# EAGLE design controladorBrassagem (EAGLE 9.6.2)
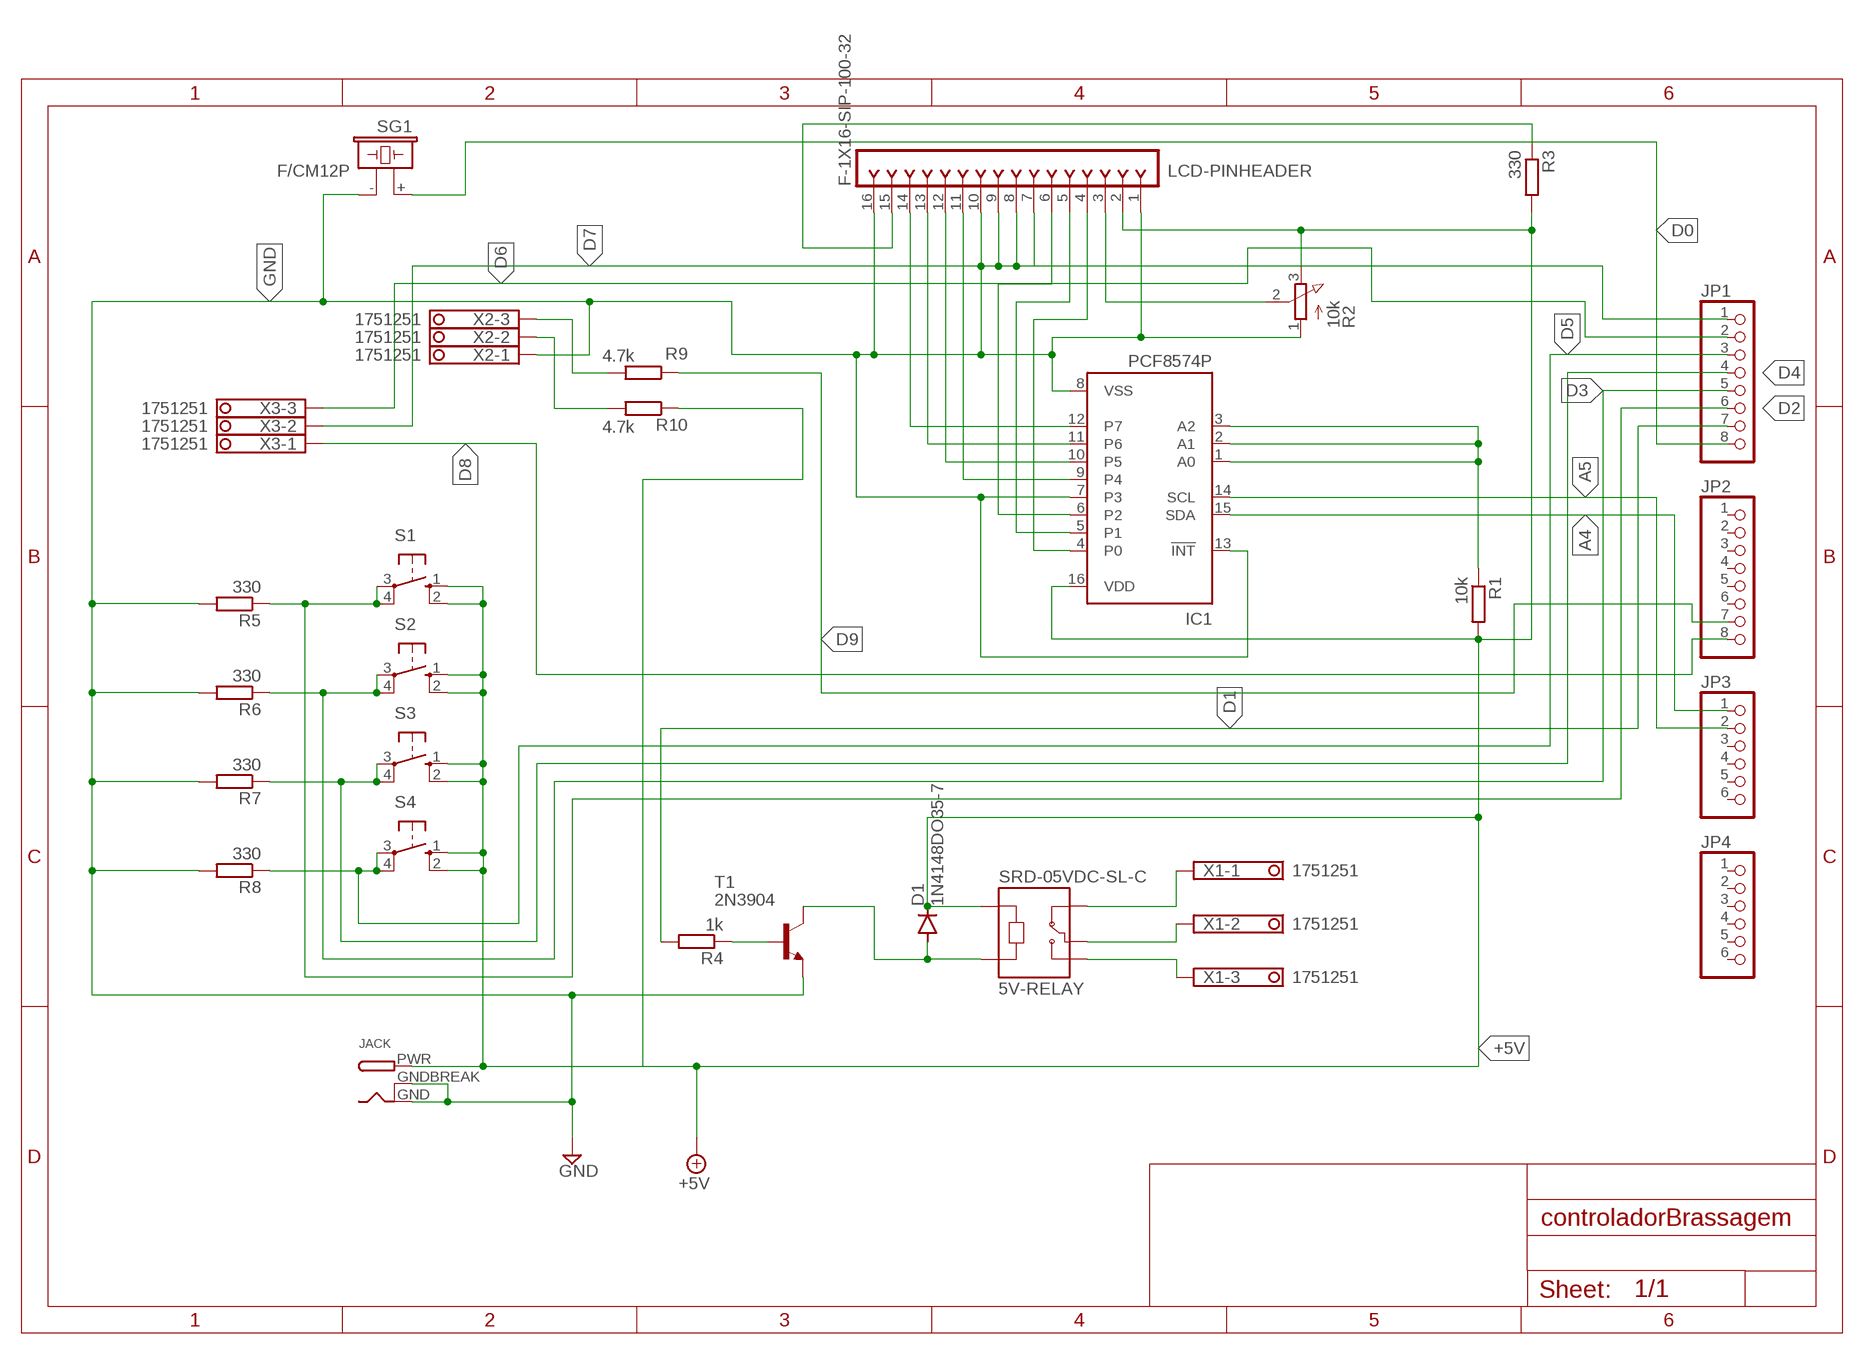
[diagram p0: schematic, sheet 1]

## Parts
5V-RELAY  SRD-05VDC-SL-C  [RELAY_SRD-05VDC-SL-C]
D1  1N4148DO35-7  [DO35-7]
IC1  PCF8574P  [DIL16]
JACK  DCBARRELPTH  [DCJACK_2MM_PTH]
JP1  PINHD-1X8  [1X08]
JP2  PINHD-1X8  [1X08]
JP3  PINHD-1X6  [1X06]
JP4  PINHD-1X6  [1X06]
LCD-PINHEADER  F-1X16-SIP-100-32  [SIP-100-16-32]
R1  10k  R-EU_0207/10  [0207/10]
R2  10k  3RP/1610N  [3RP/1610N]
R3  330  R-EU_0207/10  [0207/10]
R4  1k  R-EU_0207/10  [0207/10]
R5  330  R-EU_0207/10  [0207/10]
R6  330  R-EU_0207/10  [0207/10]
R7  330  R-EU_0207/10  [0207/10]
R8  330  R-EU_0207/10  [0207/10]
R9  4.7k  R-EU_0207/10  [0207/10]
R10  4.7k  R-EU_0207/10  [0207/10]
S1  10-XX  [B3F-10XX]
S2  10-XX  [B3F-10XX]
S3  10-XX  [B3F-10XX]
S4  10-XX  [B3F-10XX]
SG1  F/CM12P  [F/CM12P]
T1  2N3904  [TO92]
X1  1751251  [1751251]
X2  1751251  [1751251]
X3  1751251  [1751251]

## Nets
+5V: 5V-RELAY.A2 D1.C IC1.16(VDD) JACK.PWR LCD-PINHEADER.2 R1.2 R2.3(E) R3.2 R10.1 S1.1(S) S1.2(S1) S2.1(S) S2.2(S1) S3.1(S) S3.2(S1) S4.1(S) S4.2(S1)
A4: IC1.15(SDA) JP3.1
A5: IC1.14(SCL) JP3.2
D0: JP1.8 SG1.+
D1: JP1.7 R4.2
D2: JP1.6 R5.1 S1.3(P) S1.4(P1)
D3: JP1.5 R6.1 S2.3(P) S2.4(P1)
D4: JP1.4 R7.1 S3.3(P) S3.4(P1)
D5: JP1.3 R8.1 S4.3(P) S4.4(P1)
D6: JP1.2 X3.3
D7: JP1.1 X3.2
D8: JP2.8 X3.1
D9: JP2.7 R9.1
GND: IC1.7(P3) IC1.8(VSS) IC1.13(!INT) JACK.GND JACK.GNDBREAK LCD-PINHEADER.1 LCD-PINHEADER.7 LCD-PINHEADER.8 LCD-PINHEADER.9 LCD-PINHEADER.10 LCD-PINHEADER.16 R2.1(A) R5.2 R6.2 R7.2 R8.2 SG1.- T1.3(E) X2.1
N$1: IC1.1(A0) IC1.2(A1) IC1.3(A2) R1.1
N$2: LCD-PINHEADER.3 R2.2(S)
N$3: IC1.4(P0) LCD-PINHEADER.4
N$4: IC1.5(P1) LCD-PINHEADER.5
N$5: IC1.6(P2) LCD-PINHEADER.6
N$6: IC1.9(P4) LCD-PINHEADER.11
N$7: IC1.10(P5) LCD-PINHEADER.12
N$8: IC1.11(P6) LCD-PINHEADER.13
N$9: IC1.12(P7) LCD-PINHEADER.14
N$10: LCD-PINHEADER.15 R3.1
N$11: R9.2 X2.3
N$12: R4.1 T1.2(B)
N$13: 5V-RELAY.A1 D1.A T1.1(C)
N$14: 5V-RELAY.NC X1.1
N$15: 5V-RELAY.COM X1.2
N$16: 5V-RELAY.NO X1.3
N$17: R10.2 X2.2
Unconnected: JP2.1 JP2.2 JP2.3 JP2.4 JP2.5 JP2.6 JP3.3 JP3.4 JP3.5 JP3.6 JP4.1 JP4.2 JP4.3 JP4.4 JP4.5 JP4.6

## Library data of the parts
5V-RELAY = SRD-05VDC-SL-C:SRD-05VDC-SL-C: 5V Trigger Relay Module For Arduino And Raspberry Pi 5V Trigger Relay Module For Arduino And Raspberry Pi Check prices <https://pricing.snapeda.com/parts/SRD-05VDC-SL-C/Songle%20Relay/view-part?ref=eda>; AVAILABILITY: No availability data; DESCRIPTION: 5V Trigger Relay Module For Arduino And Raspberry Pi 5V Trigger Relay Module For Arduino And Raspberry Pi; MF: Songle Relay; MP: SRD-05VDC-SL-C; PACKAGE: None; PRICE: None
D1 = diode:1N4148: DIODE high speed (Philips)
IC1 = micro-philips:PCF8574: I2C-Bus Remote 8-bit I/O expander http://www.semiconductors.philips.com/acrobat_download/datasheets/PCF8574_4.pdf; MPN: PCF8574PN; OC_FARNELL: 204020; OC_NEWARK: 11N8515
JACK = adafruit:DCBARREL: 2.0mm DC Barrel Jack DCJACK_2MM_PTH - Through Hole Jack (4UConnector: 05537)
JP1 JP2 = pinhead:PINHD-1X8: PIN HEADER
JP3 JP4 = pinhead:PINHD-1X6: PIN HEADER
LCD-PINHEADER = con-headers-jp:F-1X16-: FEMALE HEADER
R1 R3-R10 = resistor:R-EU_: RESISTOR, European symbol
R2 = pot:3RP/1610N: 16mm Potentiometer one level Source: http://www.alphapotentiometers.net/html/16mm_pot_2.html
S1-S4 = DC_LOAD_AU:10-XX: OMRON SWITCH; MPN: B3F-1000; OC_FARNELL: 176432; OC_NEWARK: 36M3542
SG1 = buzzer:F/CM12P: BUZZER Source: Buerklin; OC_FARNELL: unknown; OC_NEWARK: unknown
T1 = transistor:2N3904: NPN TRANSISTOR
X1-X3 = con-phoenix-350:1751251: MKDS 1/ 3-3,5 Printklemme Nennstrom: 10 A Bemessungsspannung: 160 V Raster: 3,5 mm Polzahl: 3 Montageart: Löten Anschlussart: Schraubanschluss Anschlussrichtung vom Leiter zur Platine: 0° Source: http://eshop.phoenixcontact.com .. 1751251.pdf; OC_FARNELL: unknown; OC_NEWARK: unknown

## Board
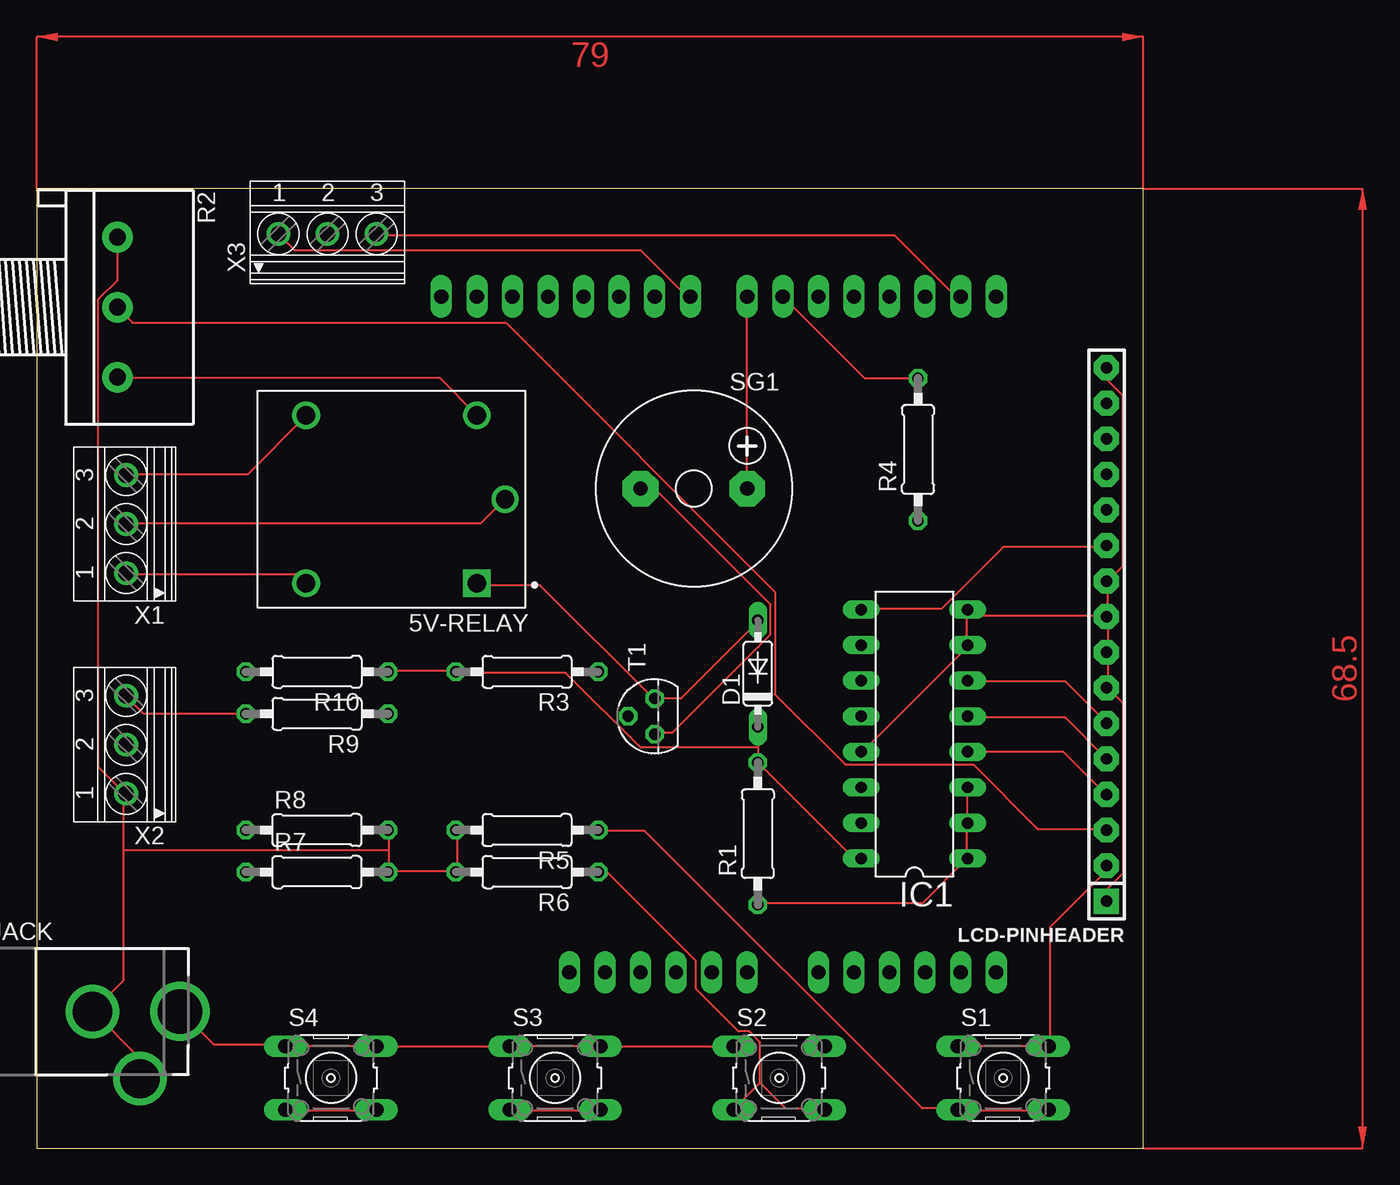
[diagram p1: board, top side]
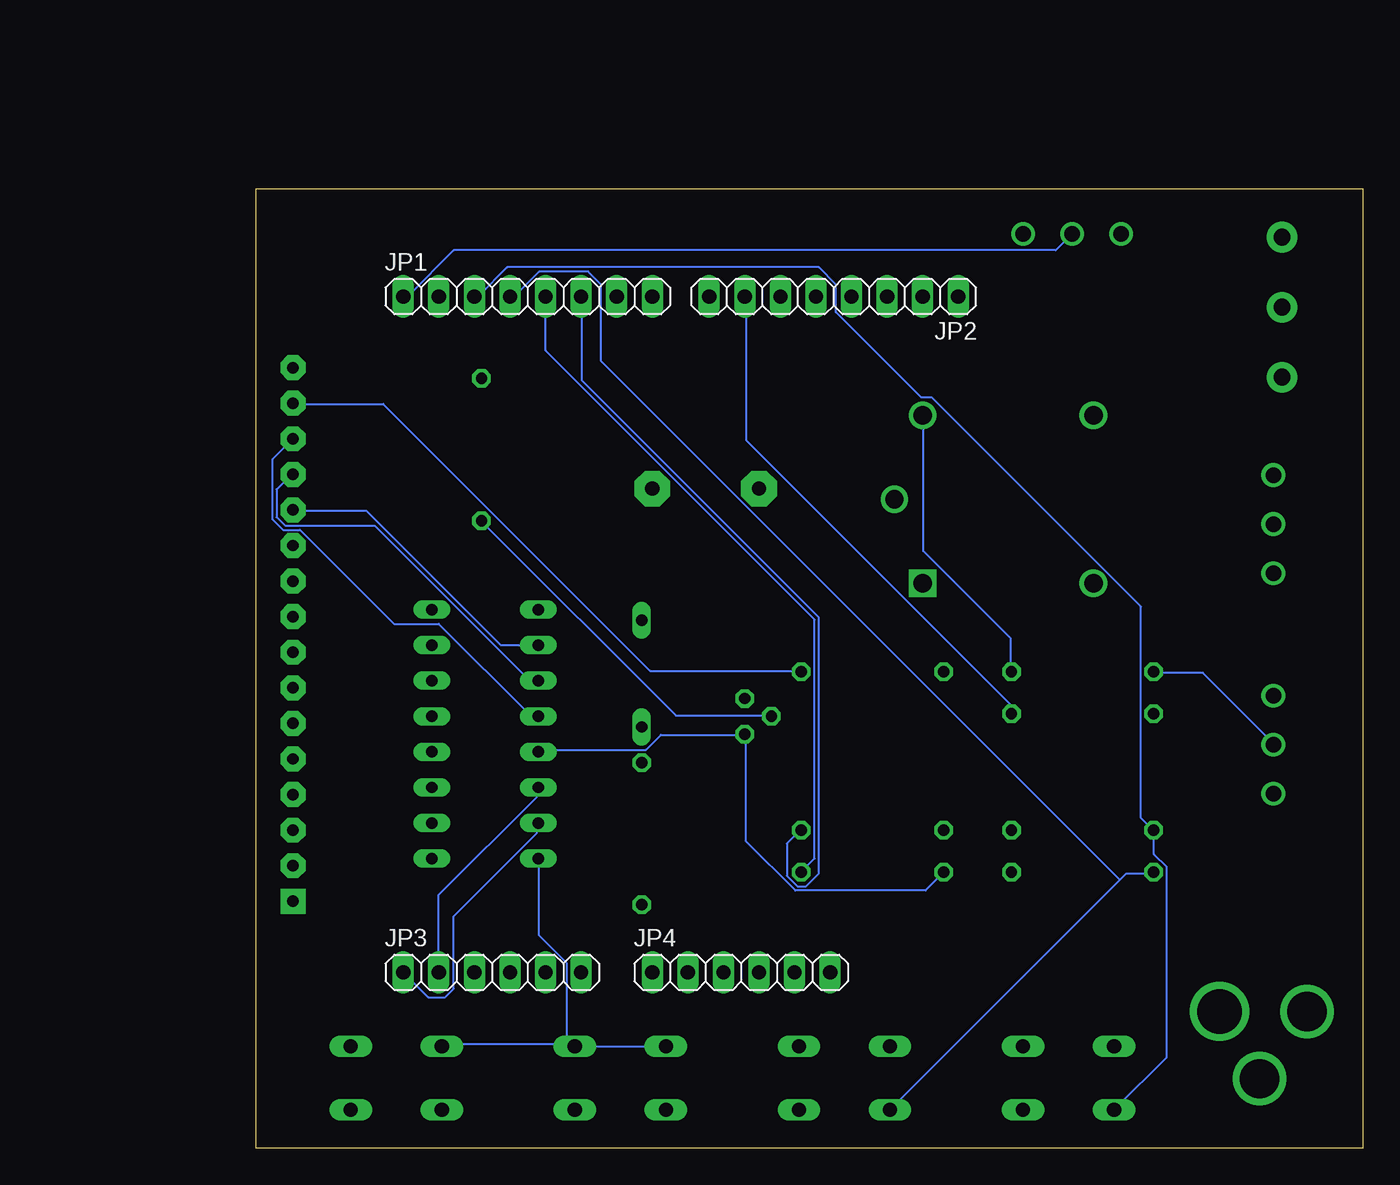
[diagram p2: board, bottom side, seen from below]

Size 79 x 68.5 mm. Coordinates in mm from the lower left corner, seen from the top.
Outline: 0,0 79,0 79,68.5 0,68.5 0,0
Copper layers (1*16): Top 0.035mm / dielectric 1.5mm / Bottom 0.035mm
Design rules "default": minimum track width 6mil, minimum drill 0.35mm, track to track 6mil, track to pad 6mil, pad to pad 6mil, via to via 6mil, smd to smd 6mil, copper to edge 40mil, drill to drill 6mil, minimum pad ring 10mil, minimum via ring 8mil, stop-mask expansion 4mil, vias tented up to drill 0mil, thermal gap 10mil

### Footprints (pad centres in the part's own frame; a part is rotated, then mirrored left to right if it is on the bottom)
RELAY_SRD-05VDC-SL-C = drill 1.32 square: A1 -6.1,6 | drill 1.32: A2 -6.1,-6; NC 6.1,6; NO 6.1,-6 | drill 1.29: COM -8.1,0
DO35-7 = drill 0.813 long: A 3.81,0; C -3.81,0
DIL16 = drill 0.813 long: 1 -8.89,-3.81; 2 -6.35,-3.81; 3 -3.81,-3.81; 4 -1.27,-3.81; 5 1.27,-3.81; 6 3.81,-3.81; 7 6.35,-3.81; 8 8.89,-3.81; 9 8.89,3.81; 10 6.35,3.81; 11 3.81,3.81; 12 1.27,3.81; 13 -1.27,3.81; 14 -3.81,3.81; 15 -6.35,3.81; 16 -8.89,3.81
DCJACK_2MM_PTH = drill 2.8: GND 0,7.35; GNDBREAK 4.8,10.75 | drill 3.2: PWR 0,13.6
1X08 = drill 1.016 long: 1 -8.89,0; 2 -6.35,0; 3 -3.81,0; 4 -1.27,0; 5 1.27,0; 6 3.81,0; 7 6.35,0; 8 8.89,0
1X06 = drill 1.016 long: 1 -6.35,0; 2 -3.81,0; 3 -1.27,0; 4 1.27,0; 5 3.81,0; 6 6.35,0
SIP-100-16-32 = drill 0.813 pad 1.778 square: 1 -19.05,0 | drill 0.813 pad 1.778 octagon: 2 -16.51,0; 3 -13.97,0; 4 -11.43,0; 5 -8.89,0; 6 -6.35,0; 7 -3.81,0; 8 -1.27,0; 9 1.27,0; 10 3.81,0; 11 6.35,0; 12 8.89,0; 13 11.43,0; 14 13.97,0; 15 16.51,0; 16 19.05,0
0207/10 = drill 0.813 octagon: 1 -5.08,0; 2 5.08,0
3RP/1610N = drill 1.2 pad 2.184: 1 -5,0; 2 0,0; 3 5,0
B3F-10XX = drill 1.016 long: 1 -3.251,2.261; 2 3.251,2.261; 3 -3.251,-2.261; 4 3.251,-2.261
F/CM12P = drill 1.016 pad 2.54 octagon: + 3.81,0; - -3.81,0
TO92 = drill 0.813 octagon: 1 1.27,0; 2 0,1.905; 3 -1.27,0
1751251 = drill 1.1 pad 1.7: 1 -3.5,-0.1; 2 0,-0.1; 3 3.5,-0.1

### Placement (x,y rotation side)
5V-RELAY  25.32,46.32 180 top
D1  51.48,33.88 90 top
IC1  62.66,29.56 90 top
JACK  -3.38,9.75 270 top
JP1  59.61,60.8 0 bottom
JP2  37.77,60.8 180 bottom
JP3  62.15,12.54 0 bottom
JP4  44.37,12.54 0 bottom
LCD-PINHEADER  76.37,36.67 90 top
R1  51.48,22.45 90 top
R2  5.76,60.04 270 top
R3  35,34 180 top
R4  62.91,49.88 90 top
R5  35,22.7 180 top
R6  35,19.7 180 top
R7  20,19.7 0 top
R8  20,22.7 0 top
R9  20,31 180 top
R10  20,34 180 top
S1  69,5 0 top
S2  53,5 0 top
S3  37,5 0 top
S4  21,5 0 top
SG1  46.91,47.08 0 top
T1  44.12,30.83 90 top
X1  6.27,44.54 90 top
X2  6.27,28.8 90 top
X3  20.75,65.37 0 top

### Tracks (layer width: path | path; a pad name or v marks a point on that pad's centre or on a via)
+5V
  Top 0.152: R10.1 25.12,34.08 29.84,34.08 R3.2 29.99,33.93 37.77,33.93 43.1,28.59 51.48,28.59 | R2.3 5.76,54.96 28.77,54.96 31.36,52.37 5V-RELAY.A2 | S1.1 65.81,7.26 72.21,7.26 S1.2 72.36,7.41 72.36,15.79 76.32,19.75 76.32,20.06 LCD-PINHEADER.2 | D1.C 51.48,28.59 | 51.48,28.59 R1.2 58.34,20.67 IC1.16 | JACK.PWR 10.33,9.7 12.62,7.41 17.65,7.41 S4.1 17.8,7.26 24.2,7.26 S4.2 24.36,7.26 33.65,7.26 S3.1 33.8,7.26 40.2,7.26 S3.2 40.36,7.26 49.65,7.26 S2.1
  Bottom 0.152: 5V-RELAY.A2 31.36,52.22 31.36,42.61 25.12,36.36 25.12,34.08 R10.1 | S2.1 49.81,7.26 56.21,7.26 S2.2 | 56.82,7.87 56.82,13.2 58.8,15.18 58.8,20.67 IC1.16 | 56.82,7.87 56.36,7.41 S2.2 | 56.82,7.87 57.27,7.41 65.66,7.41 S1.1 | 56.82,7.87 S2.2
A4
  Bottom 0.152: JP3.1 66.72,10.76 65.5,10.76 64.89,11.37 64.89,16.55 58.95,22.5 58.95,23.11 IC1.15
A5
  Bottom 0.152: JP3.2 65.96,18.08 58.95,25.09 58.95,25.7 IC1.14
D0
  Top 0.152: SG1.+ JP1.8
D1
  Top 0.152: R4.2 59.1,54.96 JP1.7
D2
  Top 0.152: R5.1 40.2,22.65 43.41,22.65 63.22,2.84 65.66,2.84 S1.3 65.81,2.68 72.21,2.68 S1.4
  Bottom 0.152: JP1.6 55.75,60.75 55.75,54.81 38.83,37.89 38.83,19.6 39.75,18.69 40.36,18.69 41.12,19.45 41.12,21.73 40.2,22.65 R5.1
D3
  Top 0.152: 51.63,4.67 51.63,7.56 50.87,8.32 50.11,8.32 47.06,11.37 47.06,13.35 40.81,19.6 40.2,19.6 R6.1 | 51.63,4.67 49.81,2.84 S2.3 | 51.63,4.67 53.46,2.84 56.21,2.84 S2.4
  Bottom 0.152: JP1.5 58.34,56.94 39.14,37.74 39.14,20.67 40.05,19.75 R6.1
D4
  Top 0.152: S3.4 40.2,2.68 33.8,2.68 S3.3
  Bottom 0.152: 17.34,19.14 33.65,2.84 S3.3 | 17.34,19.14 16.89,19.6 15.06,19.6 R7.1 | 17.34,19.14 54.38,56.18 54.38,61.66 55.29,62.58 58.8,62.58 60.47,60.9 60.78,60.9 JP1.4
D5
  Top 0.152: S4.4 24.2,2.68 17.8,2.68 S4.3
  Bottom 0.152: S4.3 17.65,2.84 13.99,6.5 13.99,20.06 14.91,20.97 14.91,22.65 R8.1 15.06,22.8 15.82,23.56 15.82,38.65 30.76,53.59 31.52,53.59 37.61,59.68 37.61,61.66 38.83,62.88 61.08,62.88 63.06,60.9 63.37,60.9 JP1.3
D6
  Top 0.152: JP1.2 65.96,60.9 65.5,60.9 61.24,65.17 24.36,65.17 X3.3
D7
  Bottom 0.152: JP1.1 68.4,60.9 68.09,60.9 64.89,64.1 21.92,64.1 20.85,65.17 X3.2
D8
  Top 0.152: JP2.8 46.6,60.9 46.3,60.9 43.1,64.1 18.41,64.1 17.34,65.17 X3.1
D9
  Bottom 0.152: R9.1 25.12,31.03 25.12,31.64 44.01,50.54 44.01,60.75 JP2.7
GND
  Top 0.152: 76.48,32.86 77.54,31.79 77.54,19.6 76.48,18.53 76.48,17.62 LCD-PINHEADER.1 | LCD-PINHEADER.9 76.48,37.89 76.48,35.45 LCD-PINHEADER.8 76.48,35.3 76.48,32.86 | 76.48,40.48 76.48,38.04 LCD-PINHEADER.9 | 76.48,40.48 77.54,41.55 77.54,53.74 76.48,54.81 76.48,55.72 LCD-PINHEADER.16 | 76.48,40.48 LCD-PINHEADER.10 | 76.48,32.86 LCD-PINHEADER.7 | IC1.13 58.95,28.29 66.57,35.91 IC1.7 66.42,35.91 66.42,38.04 | 66.42,38.04 66.42,38.35 IC1.8 66.42,38.04 | SG1.- 43.1,47.03 44.17,47.03 52.4,38.8 52.4,36.67 45.39,29.66 44.17,29.66 T1.3 | 66.42,38.04 76.32,38.04 LCD-PINHEADER.9 | 25.12,21.28 25.12,22.65 R8.2 | 25.12,21.28 25.12,19.75 | R5.2 29.99,22.65 29.99,19.75 R6.2 29.84,19.75 25.12,19.75 | 25.12,19.75 R7.2 | 6.22,21.28 6.22,11.98 4.09,9.85 JACK.GND 4.09,9.7 7.29,6.5 7.29,4.97 JACK.GNDBREAK | 6.22,21.28 6.22,25.24 X2.1 6.22,25.39 4.39,27.22 4.39,60.6 5.76,61.97 R2.1 | 6.22,21.28 25.12,21.28
  Bottom 0.152: IC1.13 58.8,28.29 58.65,28.44 51.18,28.44 50.11,29.51 44.17,29.51 T1.3 44.01,29.51 44.01,21.89 40.51,18.38 31.21,18.38 29.99,19.6 R6.2
N$1
  Top 0.152: IC1.3 66.42,25.7 66.42,23.26 IC1.2 66.42,23.11 66.42,20.67 | 66.42,20.67 63.22,17.47 51.48,17.47 R1.1 | 66.42,20.67 IC1.1
N$2
  Top 0.152: LCD-PINHEADER.3 76.32,22.8 71.45,22.8 66.87,27.37 57.73,27.37 52.7,32.4 52.7,39.72 33.5,58.92 6.83,58.92 5.76,59.99 R2.2
N$3
  Top 0.152: IC1.4 73.28,28.29 76.32,25.24 LCD-PINHEADER.4
N$4
  Top 0.152: LCD-PINHEADER.5 73.43,30.73 66.57,30.73 IC1.5
N$5
  Top 0.152: IC1.6 66.57,33.32 73.43,33.32 76.32,30.42 LCD-PINHEADER.6
N$6
  Top 0.152: IC1.9 58.95,38.5 64.59,38.5 69.01,42.92 76.32,42.92 LCD-PINHEADER.11
N$7
  Bottom 0.152: IC1.10 61.54,35.91 71.14,45.51 76.32,45.51 LCD-PINHEADER.12
N$8
  Bottom 0.152: IC1.11 58.95,33.47 59.56,33.47 70.53,44.44 76.93,44.44 77.54,45.05 77.54,47.03 76.48,48.1 LCD-PINHEADER.13
N$9
  Bottom 0.152: LCD-PINHEADER.14 77.85,49.17 77.85,44.9 77.08,44.14 75.87,44.14 69.16,37.43 65.96,37.43 59.41,30.88 58.95,30.88 IC1.12
N$10
  Bottom 0.152: R3.1 40.2,34.08 50.87,34.08 69.92,53.13 76.32,53.13 LCD-PINHEADER.15
N$11
  Top 0.152: R9.2 14.91,31.03 7.59,31.03 6.37,32.25 X2.3
N$12
  Bottom 0.152: T1.2 42.34,30.88 49.04,30.88 62.91,44.75 R4.1
N$13
  Top 0.152: D1.A 51.48,37.58 46,32.1 T1.1 44.01,32.1 35.94,40.17 31.52,40.17 5V-RELAY.A1
N$14
  Top 0.152: X1.1 6.37,40.94 18.56,40.94 19.17,40.33 5V-RELAY.NC
N$15
  Top 0.152: X1.2 6.37,44.59 31.67,44.59 33.35,46.27 5V-RELAY.COM
N$16
  Top 0.152: X1.3 6.37,48.1 15.06,48.1 19.17,52.22 5V-RELAY.NO
N$17
  Bottom 0.152: R10.2 14.91,33.93 11.4,33.93 6.37,28.9 X2.2
(copper drawn outside any net)
  shapes: Top area x2